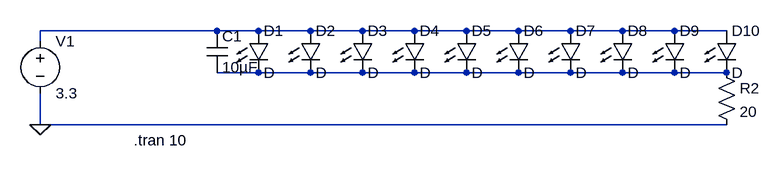
[diagram p0: schematic LED_sequence.asc]
LED_sequence.asc, the LTspice schematic file:
Version 4
SHEET 1 1000 680
WIRE 0 96 -272 96
WIRE 64 96 0 96
WIRE 144 96 64 96
WIRE 224 96 144 96
WIRE 304 96 224 96
WIRE 384 96 304 96
WIRE 464 96 384 96
WIRE 544 96 464 96
WIRE 624 96 544 96
WIRE 704 96 624 96
WIRE 784 96 704 96
WIRE -272 112 -272 96
WIRE 64 160 0 160
WIRE 144 160 64 160
WIRE 224 160 144 160
WIRE 304 160 224 160
WIRE 384 160 304 160
WIRE 464 160 384 160
WIRE 544 160 464 160
WIRE 624 160 544 160
WIRE 704 160 624 160
WIRE 784 160 704 160
WIRE -272 240 -272 192
WIRE 784 240 -272 240
FLAG -272 240 0
SYMBOL voltage -272 96 R0
WINDOW 123 0 0 Left 0
WINDOW 39 0 0 Left 0
SYMATTR InstName V1
SYMATTR Value 3.3
SYMBOL LED 48 96 R0
SYMATTR InstName D1
SYMBOL LED 128 96 R0
SYMATTR InstName D2
SYMBOL LED 208 96 R0
SYMATTR InstName D3
SYMBOL LED 288 96 R0
SYMATTR InstName D4
SYMBOL LED 368 96 R0
SYMATTR InstName D5
SYMBOL LED 448 96 R0
SYMATTR InstName D6
SYMBOL LED 528 96 R0
SYMATTR InstName D7
SYMBOL LED 608 96 R0
SYMATTR InstName D8
SYMBOL LED 688 96 R0
SYMATTR InstName D9
SYMBOL LED 768 96 R0
SYMATTR InstName D10
SYMBOL res 768 144 R0
SYMATTR InstName R2
SYMATTR Value 20
SYMATTR SpiceLine pwr=0.25
SYMBOL cap -16 96 R0
SYMATTR InstName C1
SYMATTR Value 10µF
TEXT -128 264 Left 2 !.tran 10

The netlist it stands for:
* LED_sequence.asc
V1 N001 0 3.3
D1 N001 N002 D
D2 N001 N002 D
D3 N001 N002 D
D4 N001 N002 D
D5 N001 N002 D
D6 N001 N002 D
D7 N001 N002 D
D8 N001 N002 D
D9 N001 N002 D
D10 N001 N002 D
R2 N002 0 20 pwr=0.25
C1 N001 N002 10µF
.model D D
.lib standard.dio
.tran 10
.backanno
.end